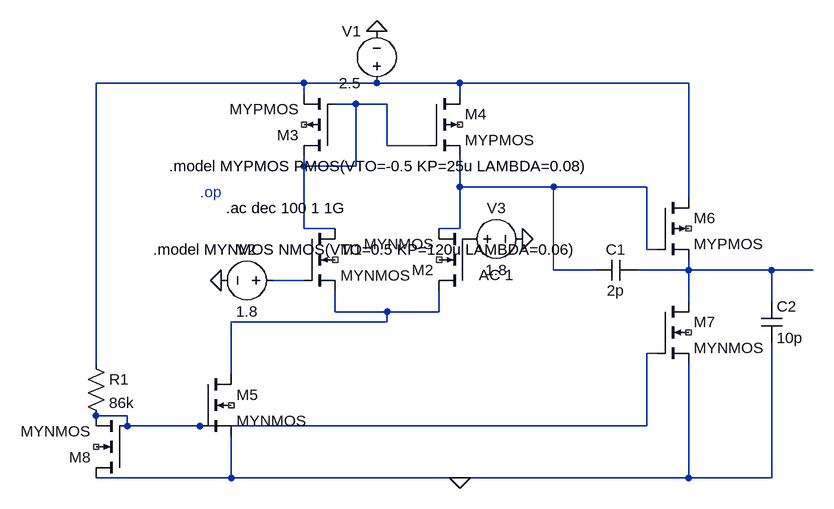
[diagram p0: schematic Draft7.asc]
Draft7.asc, the LTspice schematic file:
Version 4.1
SHEET 1 1064 680
WIRE 96 -64 -224 -64
WIRE 208 -64 96 -64
WIRE 336 -64 208 -64
WIRE 688 -64 336 -64
WIRE 96 -48 96 -64
WIRE 336 -48 336 -64
WIRE 176 -32 144 -32
WIRE 224 -32 176 -32
WIRE 224 32 224 -32
WIRE 288 32 224 32
WIRE 96 64 96 48
WIRE 176 64 176 -32
WIRE 176 64 96 64
WIRE 336 96 336 48
WIRE 480 96 336 96
WIRE 624 96 480 96
WIRE 688 112 688 -64
WIRE 96 160 96 64
WIRE 144 160 96 160
WIRE 336 160 336 96
WIRE 336 160 304 160
WIRE 624 192 624 96
WIRE 640 192 624 192
WIRE 480 224 480 96
WIRE 544 224 480 224
WIRE 688 224 688 208
WIRE 688 224 608 224
WIRE 816 224 688 224
WIRE 880 224 816 224
WIRE 96 240 48 240
WIRE 688 272 688 224
WIRE 816 272 816 224
WIRE 144 288 144 256
WIRE 224 288 144 288
WIRE 304 288 304 256
WIRE 304 288 224 288
WIRE 224 304 224 288
WIRE 224 304 -16 304
WIRE 640 352 624 352
WIRE -224 368 -224 -64
WIRE -16 384 -16 304
WIRE -176 448 -224 448
WIRE -176 464 -176 448
WIRE -64 464 -176 464
WIRE 624 464 624 352
WIRE 624 464 -64 464
WIRE -16 544 -16 480
WIRE -16 544 -224 544
WIRE 336 544 -16 544
WIRE 688 544 688 368
WIRE 688 544 336 544
WIRE 816 544 816 336
WIRE 816 544 688 544
FLAG 208 -144 0
FLAG -32 240 0
FLAG 432 176 0
FLAG 336 544 0
DATAFLAG 688 240 ""
DATAFLAG 336 112 ""
DATAFLAG 864 224 ""
SYMBOL nmos4 96 160 R0
SYMATTR InstName M1
SYMATTR Value MYNMOS
SYMATTR Value2 l=1u w=1.644u
SYMBOL nmos4 352 256 R180
SYMATTR InstName M2
SYMATTR Value MYNMOS
SYMATTR Value2 l=1u w=1.644u
SYMBOL pmos4 144 48 R180
SYMATTR InstName M3
SYMATTR Value MYPMOS
SYMATTR Value2 l=1u w=20u
SYMBOL pmos4 288 -48 R0
SYMATTR InstName M4
SYMATTR Value MYPMOS
SYMATTR Value2 l=1u w=20u
SYMBOL voltage 208 -48 R180
WINDOW 0 24 96 Left 2
WINDOW 3 24 16 Left 2
WINDOW 123 0 0 Left 0
WINDOW 39 0 0 Left 0
SYMATTR InstName V1
SYMATTR Value 2.5
SYMBOL nmos4 -176 544 R180
SYMATTR InstName M8
SYMATTR Value MYNMOS
SYMATTR Value2 l=1u w=4.44u
SYMBOL nmos4 -64 384 R0
SYMATTR InstName M5
SYMATTR Value MYNMOS
SYMATTR Value2 l=1u w=4.44u
SYMBOL nmos4 640 272 R0
SYMATTR InstName M7
SYMATTR Value MYNMOS
SYMATTR Value2 l=1u w=24.8u
SYMBOL pmos4 640 112 R0
SYMATTR InstName M6
SYMATTR Value2 l=1u w=234.5u
SYMATTR Value MYPMOS
SYMBOL cap 608 208 R90
WINDOW 0 0 32 VBottom 2
WINDOW 3 32 32 VTop 2
SYMATTR InstName C1
SYMATTR Value 2p
SYMBOL cap 800 272 R0
SYMATTR InstName C2
SYMATTR Value 10p
SYMBOL voltage 64 240 R90
WINDOW 0 -32 56 VBottom 2
WINDOW 3 32 56 VTop 2
WINDOW 123 0 0 Left 0
WINDOW 39 0 0 Left 0
SYMATTR InstName V2
SYMATTR Value 1.8
SYMBOL voltage 336 176 R270
WINDOW 0 32 56 VTop 2
WINDOW 3 -32 56 VBottom 2
WINDOW 123 -40 56 VBottom 2
WINDOW 39 0 0 Left 0
SYMATTR InstName V3
SYMATTR Value 1.8
SYMATTR Value2 AC 1
SYMBOL res -240 352 R0
SYMATTR InstName R1
SYMATTR Value 86k
TEXT -112 64 Left 2 !.model MYPMOS PMOS(VTO=-0.5 KP=25u LAMBDA=0.08)
TEXT -136 192 Left 2 !.model MYNMOS NMOS(VTO=0.5 KP=120u LAMBDA=0.06)
TEXT -64 104 Left 2 ;.op
TEXT -24 128 Left 2 !.ac dec 100 1 1G

The netlist it stands for:
* Draft7.asc
M1 N002 N005 N006 NC_01 MYNMOS l=1u w=1.644u
M2 N006 P001 N003 NC_02 MYNMOS l=1u w=1.644u
M3 N002 N002 N001 NC_03 MYPMOS l=1u w=20u
M4 N001 N002 N003 NC_04 MYPMOS l=1u w=20u
V1 N001 0 2.5
M8 0 N007 N007 NC_05 MYNMOS l=1u w=4.44u
M5 N006 N007 0 NC_06 MYNMOS l=1u w=4.44u
M7 N004 N007 0 NC_07 MYNMOS l=1u w=24.8u
M6 N001 N003 N004 NC_08 MYPMOS l=1u w=234.5u
C1 N004 N003 2p
C2 N004 0 10p
V2 N005 0 1.8
V3 P001 0 1.8 AC 1
R1 N001 N007 86k
.model NMOS NMOS
.model PMOS PMOS
.lib standard.mos
.model MYPMOS PMOS(VTO=-0.5 KP=25u LAMBDA=0.08)
.model MYNMOS NMOS(VTO=0.5 KP=120u LAMBDA=0.06)
* .op
.ac dec 100 1 1G
.backanno
.end